# Altium schematic sheet I2C_Step_12V_List2.SchDoc
size 420 x 297 mm; DocumentNumber: Введите номер платы + Э3; SheetNumber: номер страницы; Format: A3
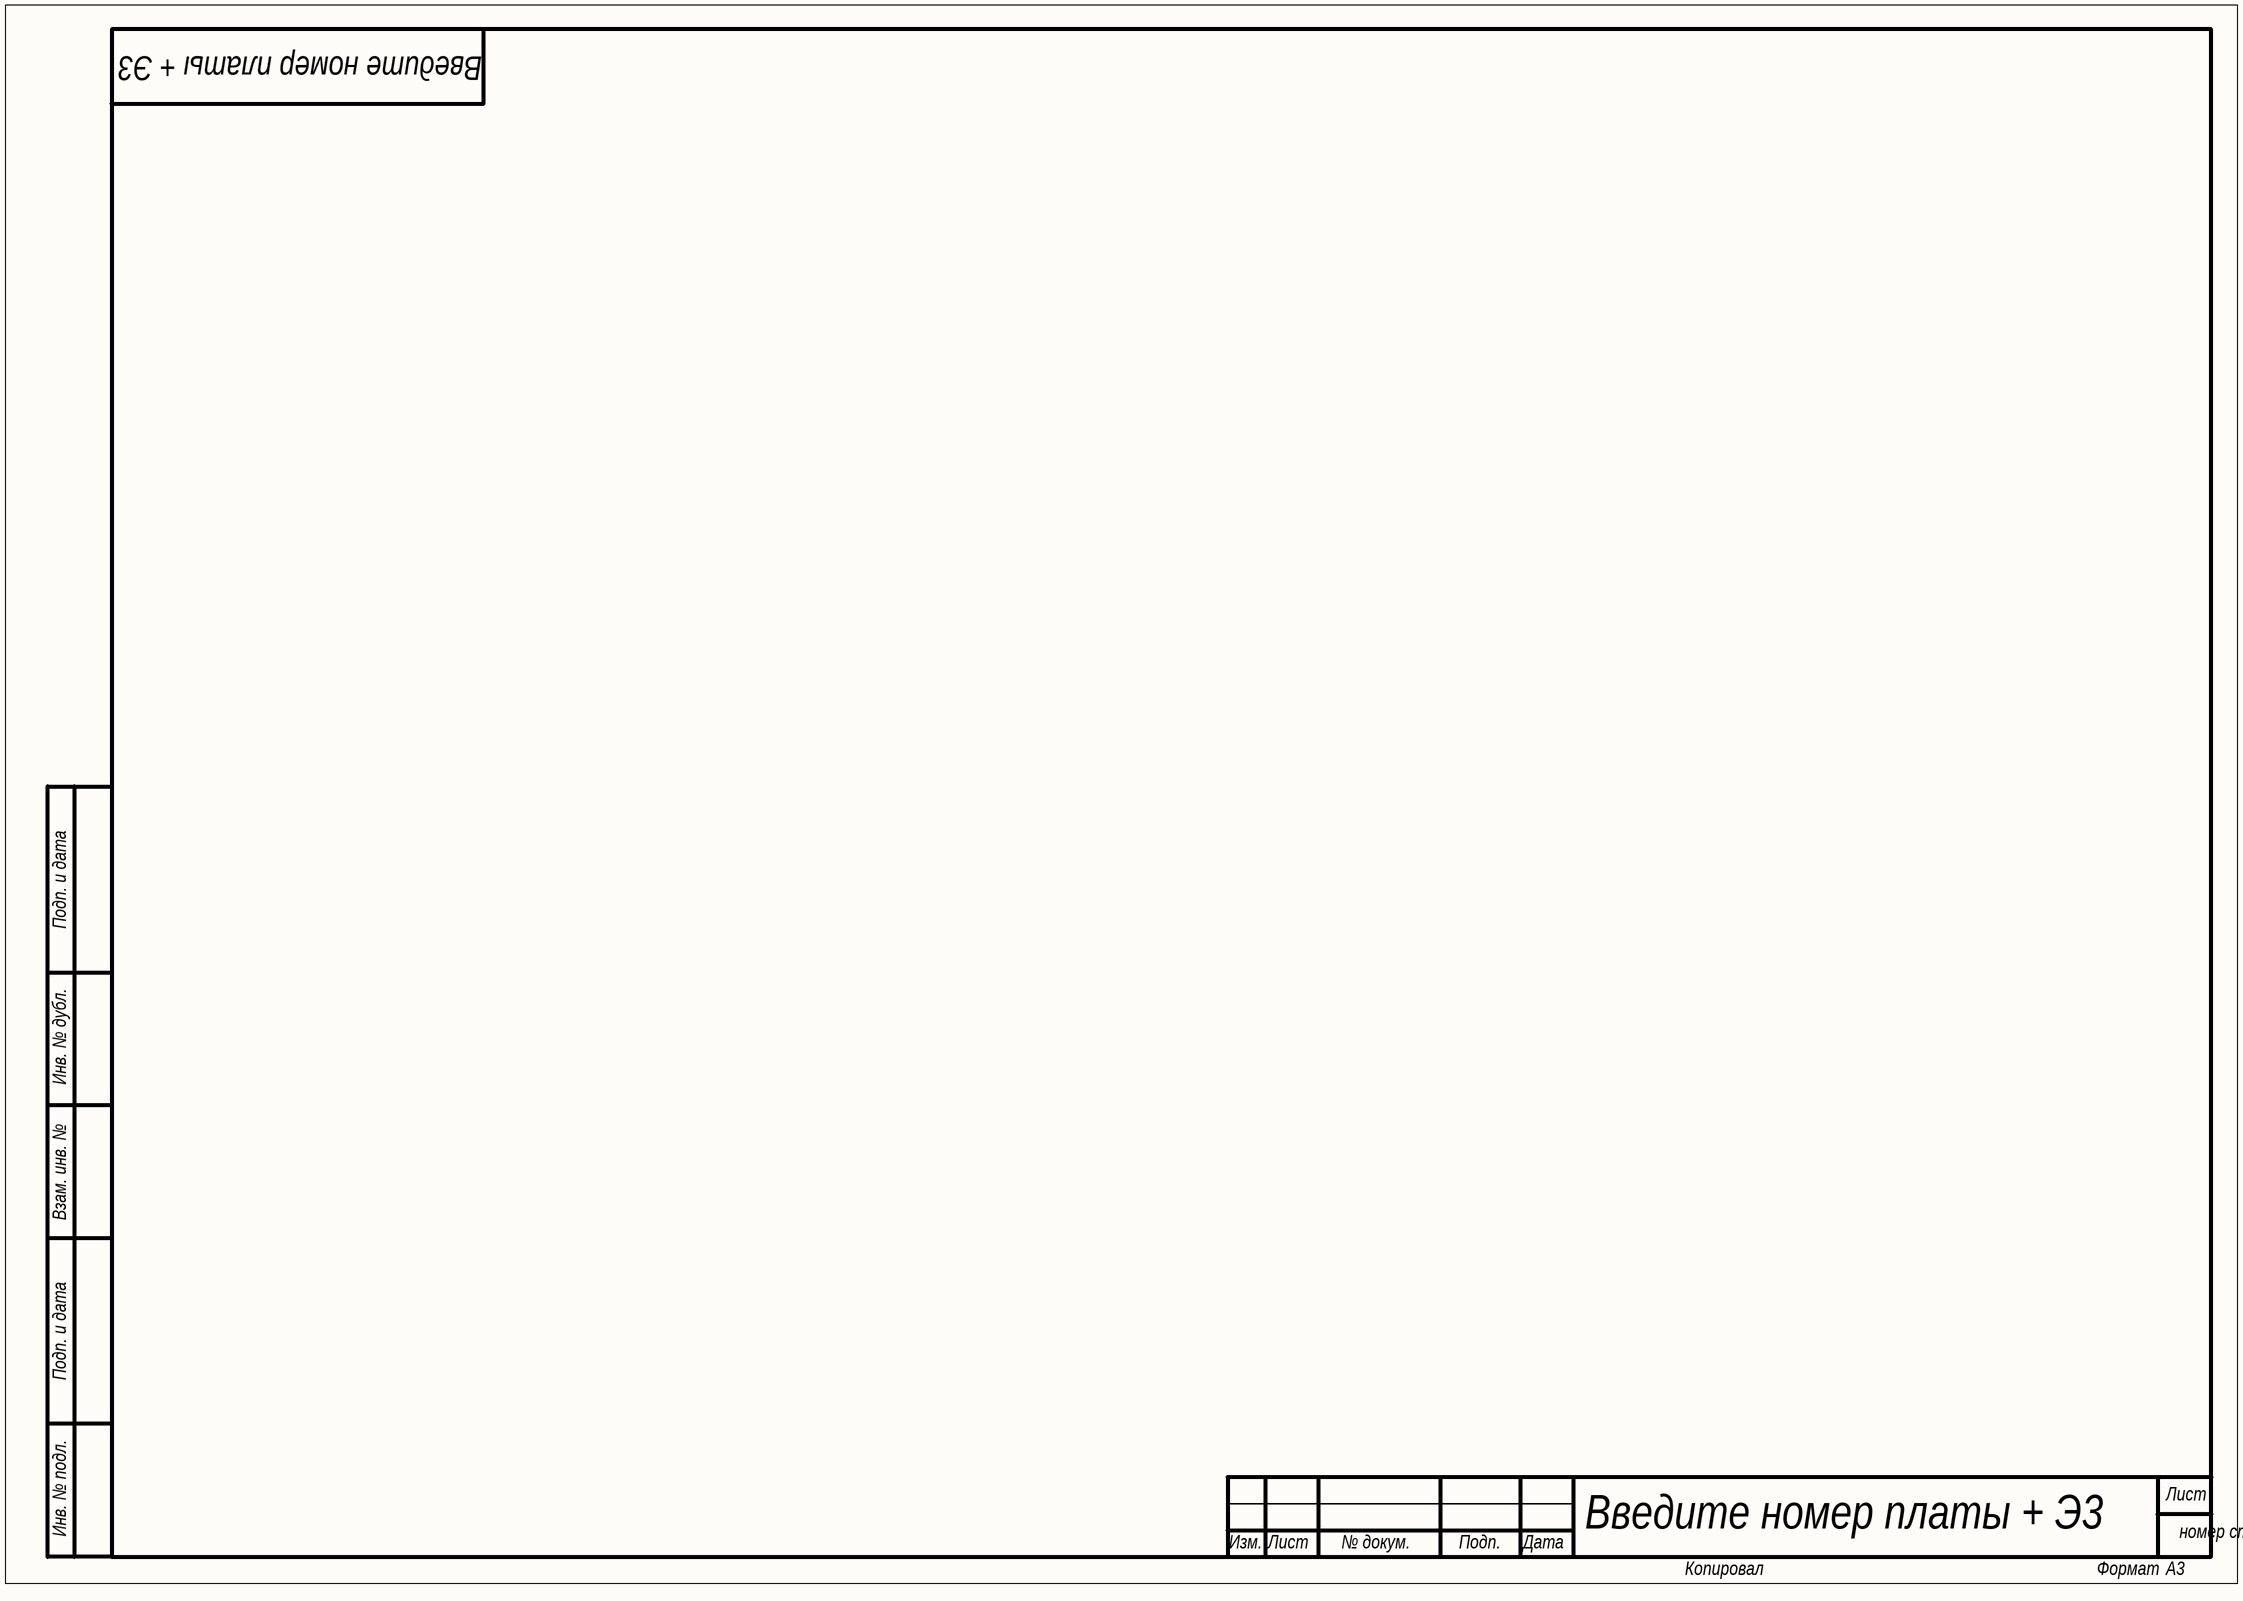
[diagram p0: I2C_Step_12V_List2.SchDoc]

## Notes on the sheet
- Подп. и дата
- Инв. № дубл.
- Взам. инв. №
- Инв. № подл.
- Лист
- Изм.
- № докум.
- Подп.
- Дата
- Копировал
- Формат